# Altium project V7.PrjPcb
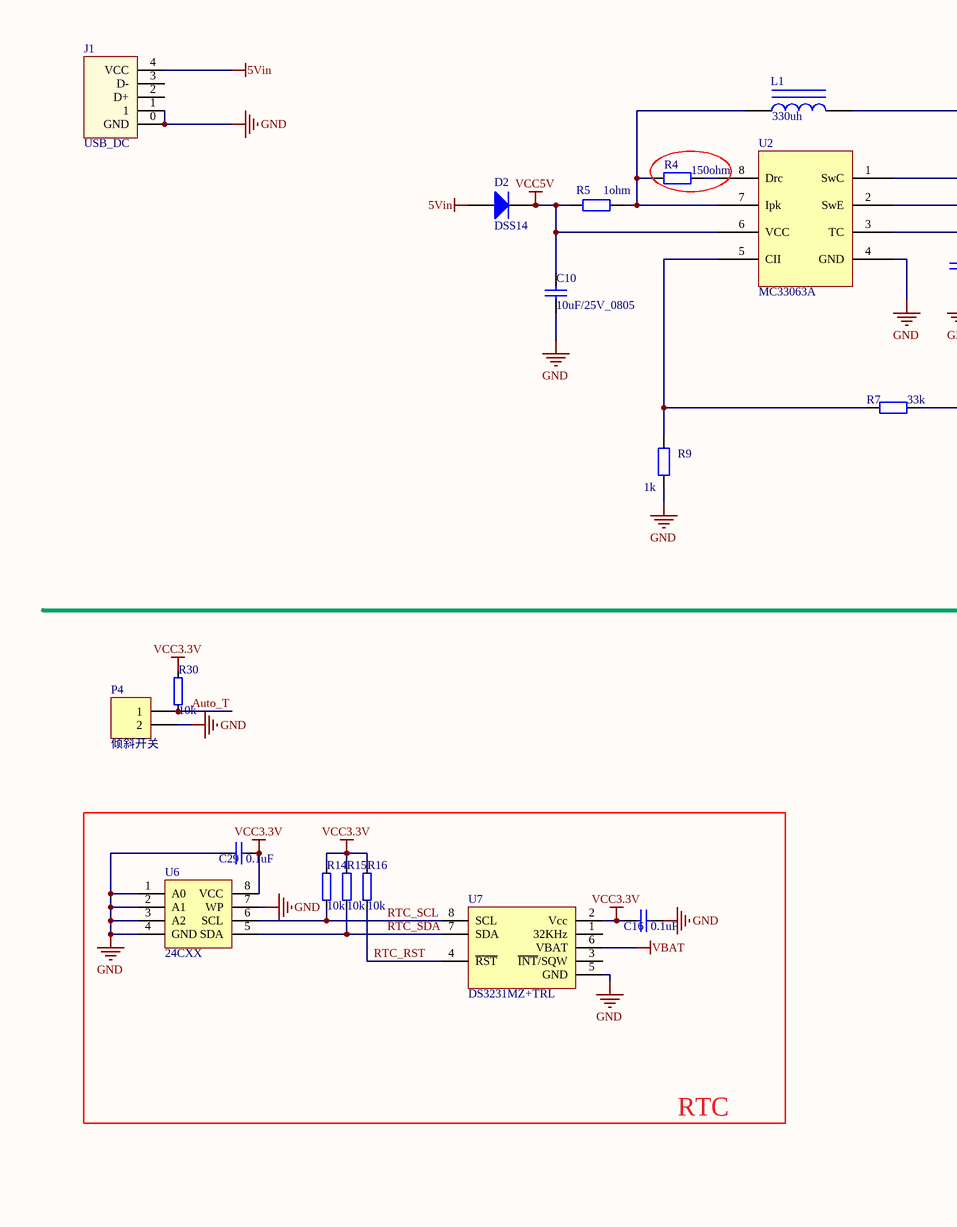
[diagram p0: V7.SchDoc, left]
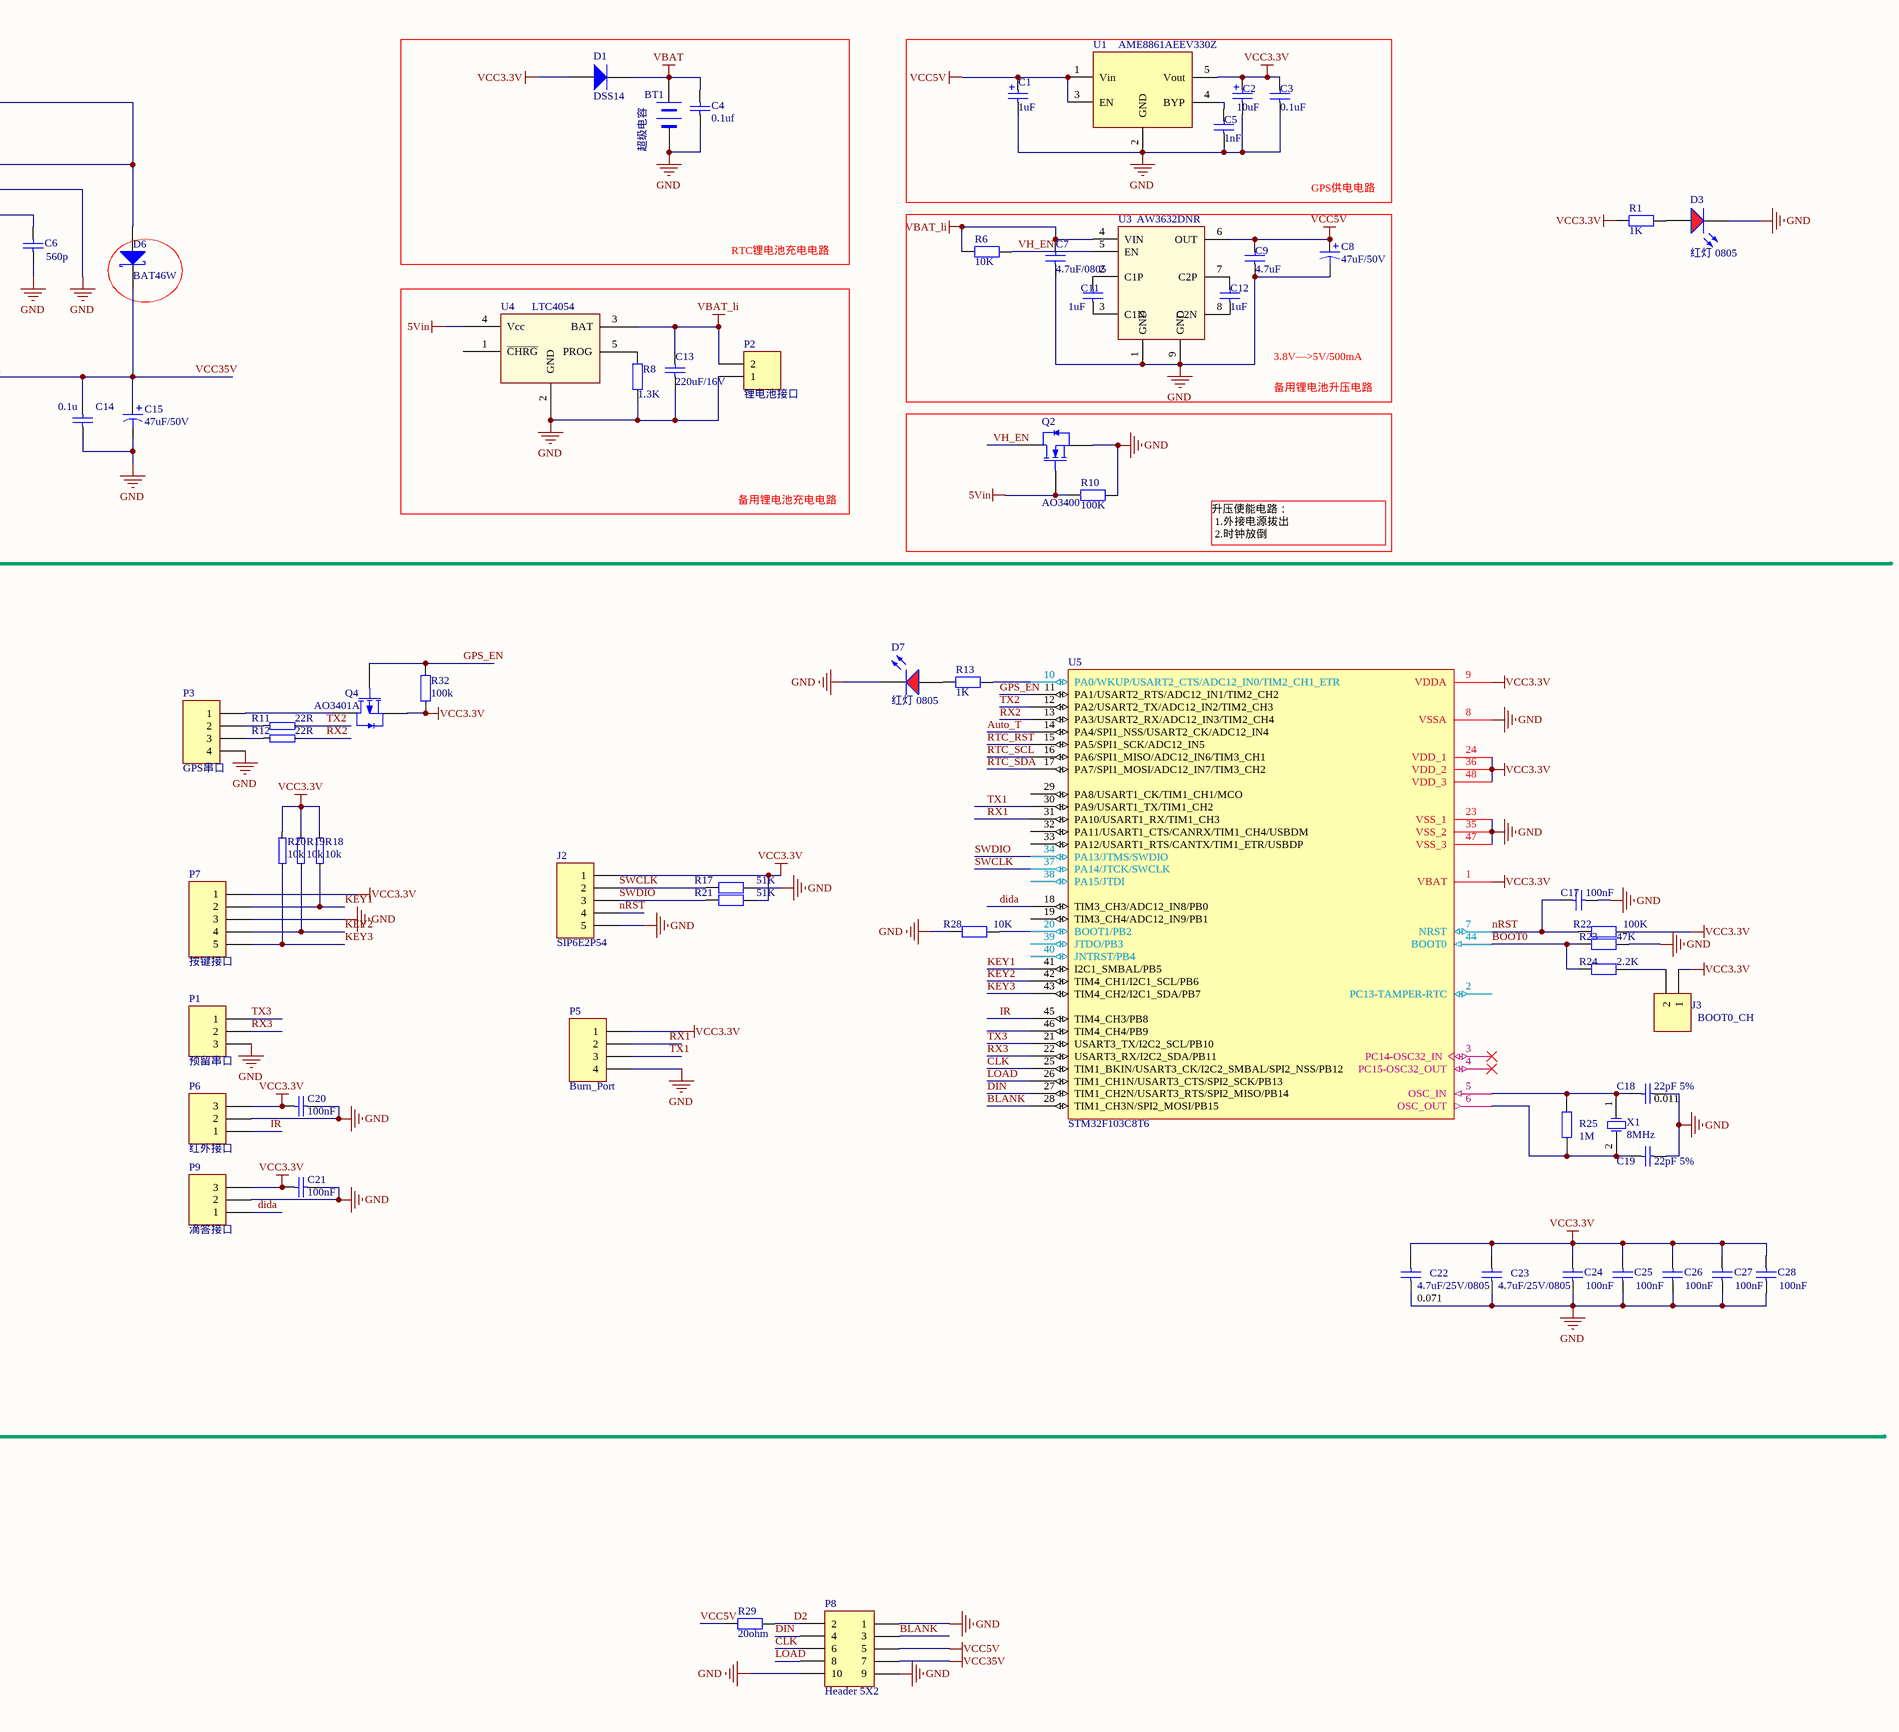
[diagram p1: V7.SchDoc, right]
1 sheet, 85 parts. Net scope: global (net labels, ports and power ports of the same name join across sheets).
Board file: V7.PcbDoc

## Sheet V7.SchDoc
size A2

### Parts
BT1  超级电容  [SF-3R3-S104Z]
C1  1uF  [C1608(CC0603)]
C2  10uF  [C2012(CC0805)]
C3  0.1uF  [C1608(CC0603)]
C4  0.1uf  [C1608(CC0603)]
C5  1nF  [C1608(CC0603)]
C6  560p  [C1608(CC0603)]
C7  4.7uF/0805  [C1608(CC0603)]
C8  47uF/50V  [铝电解电容6.3]
C9  4.7uF  [C1608(CC0603)]
C10  10uF/25V_0805  [C2012(CC0805)]
C11  1uF  [C1608(CC0603)]
C12  1uF  [C1608(CC0603)]
C13  220uF/16V  [C2012(CC0805)]
C14  0.1u  [C1608(CC0603)]
C15  47uF/50V  [铝电解电容6.3]
C16  0.1uF  [C1608(CC0603)]
C17  value 100nF  [C1608(CC0603)]  (hidden comment: 1nF)
C18  22pF 5%  [C1608(CC0603)]
C19  22pF 5%  [C1608(CC0603)]
C20  100nF  [C1608(CC0603)]
C21  100nF  [C1608(CC0603)]
C22  4.7uF/25V/0805  [C2012(CC0805)]
C23  4.7uF/25V/0805  [C2012(CC0805)]
C24  100nF  [C1608(CC0603)]
C25  100nF  [C1608(CC0603)]
C26  100nF  [C1608(CC0603)]
C27  100nF  [C1608(CC0603)]
C28  100nF  [C1608(CC0603)]
C29  0.1uF  [C1608(CC0603)]
D1  DSS14  [LC-SOD-123F]
D2  DSS14  [LC-SOD-123F]
D3  红灯 0805  [LC-0805_LED_S1]
D6  BAT46W  [INDM2716X11N]
D7  红灯 0805  [LC-0805_LED_S1]
J1  USB_DC  [USB_DC]
J2  SIP6E2P54  [HDR1X5]
J3  BOOT0_CH  [HDR1X2]
L1  330uh  [INDM7070X40N]
P1  预留串口  [HDR1X3]
P2  锂电池接口  [XH2.54-2A]
P3  GPS串口  [HDR1X4]
P4  倾斜开关  [HDR1X2]
P5  Burn_Port  [HDR1X4]
P6  红外接口  [HDR1X3]
P7  按键接口  [XH2.54-5A]
P8  Header 5X2  [HDR2X5]
P9  滴答接口  [HDR1X3]
Q2  AO3400  [LC-SOT-23-3L]
Q4  AO3401A  [LC-SOT-23-3L]
R1  1K  [C1608(CC0603)]
R4  150ohm  [C1608(CC0603)]
R5  1ohm  [C1608(CC0603)]
R6  10K  [C1608(CC0603)]
R7  33k  [C1608(CC0603)]
R8  1.3K  [C1608(CC0603)]
R9  1k  [C1608(CC0603)]
R10  100K  [C1608(CC0603)]
R11  22R  [C1608(CC0603)]
R12  22R  [C1608(CC0603)]
R13  1K  [C1608(CC0603)]
R14  10k  [C1608(CC0603)]
R15  10k  [C1608(CC0603)]
R16  10k  [C1608(CC0603)]
R17  51K  [C1608(CC0603)]
R18  10k  [C1608(CC0603)]
R19  10k  [C1608(CC0603)]
R20  10k  [C1608(CC0603)]
R21  51K  [C1608(CC0603)]
R22  value 100K  [C1608(CC0603)]  (hidden comment: 100R)
R23  47K  [C1608(CC0603)]
R24  2.2K  [C1608(CC0603)]
R25  1M  [C1608(CC0603)]
R28  value 10K  [C1608(CC0603)]  (hidden comment: 100R)
R29  20ohm  [C1608(CC0603)]
R30  10k  [C1608(CC0603)]
R32  100k  [C1608(CC0603)]
U1  AME8861AEEV330Z  [SOT23-5]
U2  MC33063A  [LC-SOP-8_150mil]
U3  AW3632DNR  [DFN_8L]
U4  LTC4054  [LC-SOT-23-5]
U5  STM32F103C8T6  [LC-LQFP-48_7x7x05P]
U6  24CXX  [LC-SOP-8_150mil]
U7  DS3231MZ+TRL  [LC-SOIC-8_150mil]
X1  8MHz  [XTAL-5032]

### Blocks framed on the sheet
RTC锂电池充电电路: BT1 C4 D1
GPS供电电路: C1-C3 C5 U1
备用锂电池充电电路: C13 P2 R8 U4
RTC: C16 C29 R14-R16 U6 U7

### Nets
5Vin: D2.1(A) J1.4(VCC) Q2.1(G) R10.2 U4.4(Vcc)
GND: BT1.2(-) C1.2 C2.2 C3.1 C4.1 C5.1 C6.2 C7.2 C8.2 C9.2 C10.1 C13.1 C14.1 C15.2 C16.1 C17.2 C18.1 C19.1 C20.2 C21.2 C22.1 C23.1 C24.2 C25.2 C26.2 C27.2 C28.2 C29.2 D3.K D7.K J1.0(GND) J1.1 J2.5 P1.3 P2.1 P3.4 P4.2 P5.4 P6.2 P7.3 P8.1 P8.9 P8.10 P9.2 Q2.2(S) R8.2 R9.1 R10.1 R17.1 R23.1 R28.1 U1.2(GND) U2.2(SwE) U2.4(GND) U3.1(GND) U3.9(GND) U4.2(GND) U5.8(VSSA) U5.23(VSS_1) U5.35(VSS_2) U5.47(VSS_3) U6.1(A0) U6.2(A1) U6.3(A2) U6.4(GND) U6.7(WP) U7.5(GND)
VBAT: BT1.1(+) C4.2 D1.2(K) U7.6(VBAT)
VBAT_li: C7.1 C13.2 P2.2 R6.1 U3.4(VIN) U4.3(BAT)
VCC3.3V: C2.1 C3.2 C16.2 C20.1 C21.1 C22.2 C23.2 C24.1 C25.1 C26.1 C27.1 C28.1 C29.1 D1.1(A) J2.1 J3.1 P5.1 P6.3 P7.1 P9.3 Q4.2(S) R1.1 R14.1 R15.1 R16.1 R18.1 R19.1 R20.1 R21.1 R22.2 R30.1 R32.2 U1.5(Vout) U5.1(VBAT) U5.9(VDDA) U5.24(VDD_1) U5.36(VDD_2) U5.48(VDD_3) U6.8(VCC) U7.2(Vcc)
VCC5V: C1.1 C8.1 C9.1 C10.2 D2.2(K) P8.5 R5.1 R29.1 U1.1(Vin) U1.3(EN) U2.6(VCC) U3.6(OUT)
VCC35V: C14.2 C15.1 D6.1 P8.7 R7.2
Auto_T: P4.1 R30.2 U5.14(PA4/SPI1_NSS/USART2_CK/ADC12_IN4)
BLANK: P8.3 U5.28(TIM1_CH3N/SPI2_MOSI/PB15)
BOOT0: R23.2 R24.1 U5.44(BOOT0)
CLK: P8.6 U5.25(TIM1_BKIN/USART3_CK/I2C2_SMBAL/SPI2_NSS/PB12)
D2: P8.2 R29.2
dida: P9.1 U5.18(TIM3_CH3/ADC12_IN8/PB0)
DIN: P8.4 U5.27(TIM1_CH2N/USART3_RTS/SPI2_MISO/PB14)
GPS_EN: Q4.1(G) R32.1 U5.11(PA1/USART2_RTS/ADC12_IN1/TIM2_CH2)
IR: P6.1 U5.45(TIM4_CH3/PB8)
KEY1: P7.2 R18.2 U5.41(I2C1_SMBAL/PB5)
KEY2: P7.4 R19.2 U5.42(TIM4_CH1/I2C1_SCL/PB6)
KEY3: P7.5 R20.2 U5.43(TIM4_CH2/I2C1_SDA/PB7)
LOAD: P8.8 U5.26(TIM1_CH1N/USART3_CTS/SPI2_SCK/PB13)
nRST: C17.1 J2.4 R22.1 U5.7(NRST)
RTC_RST: R16.2 U5.15(PA5/SPI1_SCK/ADC12_IN5) U7.4(~{RST})
RTC_SCL: R14.2 U5.16(PA6/SPI1_MISO/ADC12_IN6/TIM3_CH1) U6.6(SCL) U7.8(SCL)
RTC_SDA: R15.2 U5.17(PA7/SPI1_MOSI/ADC12_IN7/TIM3_CH2) U6.5(SDA) U7.7(SDA)
RX1: P5.2 U5.31(PA10/USART1_RX/TIM1_CH3)
RX2: R12.2 U5.13(PA3/USART2_RX/ADC12_IN3/TIM2_CH4)
RX3: P1.2 U5.22(USART3_RX/I2C2_SDA/PB11)
SWCLK: J2.2 R17.2 U5.37(PA14/JTCK/SWCLK)
SWDIO: J2.3 R21.2 U5.34(PA13/JTMS/SWDIO)
TX1: P5.3 U5.30(PA9/USART1_TX/TIM1_CH2)
TX2: R11.2 U5.12(PA2/USART2_TX/ADC12_IN2/TIM2_CH3)
TX3: P1.1 U5.21(USART3_TX/I2C2_SCL/PB10)
VH_EN: Q2.3(D) R6.2 U3.5(EN)
NetC5_2: C5.2 U1.4(BYP)
NetC6_1: C6.1 U2.3(TC)
NetC11_1: C11.1 U3.2(C1P)
NetC11_2: C11.2 U3.3(C1N)
NetC12_1: C12.1 U3.7(C2P)
NetC12_2: C12.2 U3.8(C2N)
NetC18_2: C18.2 R25.1 U5.5(OSC_IN) X1.1(OSC1)
NetC19_2: C19.2 R25.2 U5.6(OSC_OUT) X1.2(OSC2)
NetD3_A: D3.A R1.2
NetD6_2: D6.2 L1.2 U2.1(SwC)
NetD7_A: D7.A R13.2
NetJ3_2: J3.2 R24.2
NetL1_1: L1.1 R4.1 R5.2 U2.7(Ipk)
NetP3_1: P3.1 Q4.3(D)
NetP3_2: P3.2 R11.1
NetP3_3: P3.3 R12.1
NetR4_2: R4.2 U2.8(Drc)
NetR7_1: R7.1 R9.2 U2.5(CII)
NetR8_1: R8.1 U4.5(PROG)
NetR13_1: R13.1 U5.10(PA0/WKUP/USART2_CTS/ADC12_IN0/TIM2_CH1_ETR)
NetR28_2: R28.2 U5.20(BOOT1/PB2)

Not connected (* = marked no-connect by the designer): J1 2(D+) 3(D-); U4 1(~{CHRG}); U5 2(PC13-TAMPER-RTC) 3(PC14-OSC32_IN)* 4(PC15-OSC32_OUT)* 19(TIM3_CH4/ADC12_IN9/PB1) 29(PA8/USART1_CK/TIM1_CH1/MCO) 32(PA11/USART1_CTS/CANRX/TIM1_CH4/USBDM) 33(PA12/USART1_RTS/CANTX/TIM1_ETR/USBDP) 38(PA15/JTDI) 39(JTDO/PB3) 40(JNTRST/PB4) 46(TIM4_CH4/PB9); U7 1(32KHz) 3(~{INT}/SQW)

### Notes on the sheet
- 3.8V—>5V/500mA
- 备用锂电池升压电路
- 升压使能电路：
  1.外接电源拔出
  2.时钟放倒
- (near C18) 0.011
- (near C22) 0.071

### Library data of the parts
BT1 = BATTERY
C1 C2 = Cap Pol2: Polarized Capacitor (Axial); Value: 100pF; Published: 8-Jun-2000; LatestRevisionDate: 17-Jul-2002; LatestRevisionNote: Re-released for DXP Platform.; PackageReference: POLAR0.8; Publisher: Altium Limited; PackageDescription: Polarized Capacitor; 2 Leads
C3-C5 C7 C9 C11 C12 C16 C29 = Cap: Capacitor; Value: 100pF; Published: 8-Jun-2000; LatestRevisionDate: 17-Jul-2002; LatestRevisionNote: Re-released for DXP Platform.; PackageReference: RAD-0.3; Publisher: Altium Limited; PackageDescription: Radial Cap, Thru-Hole; 2 Leads; 0.3 in Pin Spacing
C6 = Cap: Capacitor; Value: 560pF; Published: 8-Jun-2000; LatestRevisionDate: 17-Jul-2002; LatestRevisionNote: Re-released for DXP Platform.; PackageReference: RAD-0.3; Publisher: Altium Limited; PackageDescription: Radial Cap, Thru-Hole; 2 Leads; 0.3 in Pin Spacing; Created: 1/08/1993
C8 C15 = Cap Pol1: E型; Published: 8-Jun-2000; LatestRevisionDate: 17-Jul-2002; LatestRevisionNote: Re-released for DXP Platform.; PackageReference: RB7.6-15; Publisher: Altium Limited; PackageDescription: Polarized Capacitor (Radial); 2 Leads; Value: 47uF/50V
C10 C13 C14 = Cap: Capacitor; Value: 0.1uF; Published: 8-Jun-2000; LatestRevisionDate: 17-Jul-2002; LatestRevisionNote: Re-released for DXP Platform.; PackageReference: RAD-0.3; Publisher: Altium Limited; PackageDescription: Radial Cap, Thru-Hole; 2 Leads; 0.3 in Pin Spacing; Created: 1/08/1993
C17-C28 = Cap: Capacitor; Published: 8-Jun-2000; LatestRevisionDate: 17-Jul-2002; LatestRevisionNote: Re-released for DXP Platform.; PackageReference: RAD-0.3; Publisher: Altium Limited
  C18 C19: Value: 22pF 5%
  C20 C21 C24-C28: Value: 100nF
  C22 C23: Value: 4.7uF/25V/0805
D1 D2 = SOD-123 B5819W  SL: 肖特基二极管; ComponentLink1Description: 供应商链接; ComponentLink1URL: http://www.szlcsc.com/product/details_9093.html; Package: SOD-123; Supplier: LC; SuppliersPartNumber: C8598
D3 D7 = 0805 红灯: 发光二极管; ComponentLink1Description: 供应商链接; ComponentLink1URL: http://www.szlcsc.com/product/details_2668.html; Package: 0805; Supplier: LC; SuppliersPartNumber: C2295
D6 = Diode 10TQ045: Schottky Rectifier; Note: Terminal 2 is the TAB and is electrically connected to the cathode; Published: 8-Jun-2000; LatestRevisionDate: 17-Jul-2002; LatestRevisionNote: Re-released for DXP Platform.; DatasheetVersion: PD-2.057B; PackageVersion: Feb-1998; PackageReference: TO-220AC; Publisher: Altium Limited; PackageDescription: TO, Thru-Hole, Vertical, Heatsink Mounted; 3 In-Line Leads (1 Absent); Pitch 2.54 mm; ComponentLink1Description: Manufacturer Link; ComponentLink1URL: http://www.irf.com/; ComponentLink2Description: Datasheet; ComponentLink2URL: http://www.irf.com/product-info/datasheets/data/10tq.pdf
J2 P7 = Header 5: Header, 5-Pin; LatestRevisionDate: 17-Jul-2002; LatestRevisionNote: Re-released for DXP Platform.; Publisher: Altium Limited
J3 P2 P4 = Header 2: Header, 2-Pin; LatestRevisionDate: 17-Jul-2002; LatestRevisionNote: Re-released for DXP Platform.; Publisher: Altium Limited
L1 = Inductor Iron: 7*7; Published: 24-Mar-1999; LatestRevisionDate: 17-Jul-2002; LatestRevisionNote: Re-released for DXP Platform.; PackageReference: AXIAL-0.9; Publisher: Altium Limited; PackageDescription: Axial Device, Thru-Hole; 2 Leads; 0.9 in Pin Spacing; Value: 330uH
P1 P6 P9 = Header 3: Header, 3-Pin; LatestRevisionDate: 17-Jul-2002; LatestRevisionNote: Re-released for DXP Platform.; Publisher: Altium Limited
P3 P5 = Header 4: Header, 4-Pin; LatestRevisionDate: 17-Jul-2002; LatestRevisionNote: Re-released for DXP Platform.; Publisher: Altium Limited
P8 = Header 5X2: Header, 5-Pin, Dual row; LatestRevisionDate: 17-Jul-2002; LatestRevisionNote: Re-released for DXP Platform.; Publisher: Altium Limited
Q2 = AO3400A N道沟 X0YV1T SOT-23: MOS(场效应管); ComponentLink1Description: 供应商链接; ComponentLink1URL: http://www.szlcsc.com/product/details_21629.html; Package: SOT-23; Supplier: LC; SuppliersPartNumber: C20917
Q4 = AO3401A P道沟 X13A15 SOT-23: MOS(场效应管); ComponentLink1Description: 供应商链接; ComponentLink1URL: http://www.szlcsc.com/product/details_15801.html; Package: SOT-23; Supplier: LC; SuppliersPartNumber: C15127
R1 R4 R5 R7 R9 R13 R17 R21-R25 R28 = Res2: Resistor; Published: 8-Jun-2000; LatestRevisionDate: 17-Jul-2002; LatestRevisionNote: Re-released for DXP Platform.; PackageReference: AXIAL-0.4; Publisher: Altium Limited
  R1 R13: Value: 1K
  R4 R5 R7: PackageDescription: Axial Device, Thru-Hole; 2 Leads; 0.4 in Pin Spacing; Created: 1/08/1993
  R9: PackageDescription: Axial Device, Thru-Hole; 2 Leads; 0.4 in Pin Spacing; Value: 1K; Created: 1/08/1993
  R17 R21: Value: 51K
  R23: Value: 47K
  R24: Value: 2.2K
  R25: Value: 1M
R6 R10 = Res2: Resistor; Value: 4.7K; Published: 8-Jun-2000; LatestRevisionDate: 17-Jul-2002; LatestRevisionNote: Re-released for DXP Platform.; PackageReference: AXIAL-0.4; Publisher: Altium Limited; PackageDescription: Axial Device, Thru-Hole; 2 Leads; 0.4 in Pin Spacing
R8 R29 R32 = Res2: Resistor; Value: 1K; Published: 8-Jun-2000; LatestRevisionDate: 17-Jul-2002; LatestRevisionNote: Re-released for DXP Platform.; PackageReference: AXIAL-0.4; Publisher: Altium Limited; PackageDescription: Axial Device, Thru-Hole; 2 Leads; 0.4 in Pin Spacing
  R29 R32: Created: 1/08/1993
R11 R12 R14-R16 R18-R20 R30 = RES5
U1 = MIC5205-3.3BM5
U2 = MC330
U5 = STM32F103C8T6: STM32 ARM-based 32-bit MCU with 64 Kbytes Flash, 48-pin LQFP, Industrial Temperature; Published: *; DatasheetVersion: *; PackageVersion: *; PackageReference: *; Publisher: *; PackageDescription: *; ComponentLink1Description: *; ComponentLink1URL: *; ComponentLink2Description: *; ComponentLink2URL: *
X1 = XTAL: Crystal Oscillator; Published: 8-Jun-2000; LatestRevisionDate: 17-Jul-2002; LatestRevisionNote: Re-released for DXP Platform.; PackageReference: R38; Publisher: Altium Limited